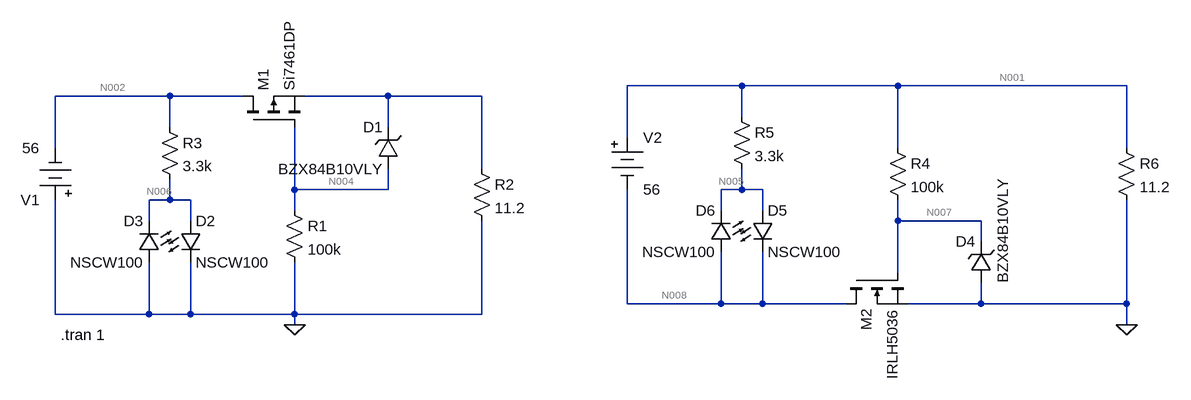
[diagram p0: schematic Polarity_Protection.asc]
Polarity_Protection.asc, the LTspice schematic file:
Version 4
SHEET 1 1516 680
WIRE 848 32 672 32
WIRE 1088 32 848 32
WIRE 1440 32 1088 32
WIRE -32 48 -208 48
WIRE 80 48 -32 48
WIRE 304 48 176 48
WIRE 448 48 304 48
WIRE 848 80 848 32
WIRE -32 96 -32 48
WIRE 304 96 304 48
WIRE 672 112 672 32
WIRE -208 128 -208 48
WIRE 1088 128 1088 32
WIRE 1440 128 1440 32
WIRE 448 160 448 48
WIRE 160 192 160 96
WIRE 304 192 304 160
WIRE 304 192 160 192
WIRE 848 192 848 160
WIRE 848 192 816 192
WIRE 880 192 848 192
WIRE -32 208 -32 176
WIRE -32 208 -64 208
WIRE 0 208 -32 208
WIRE 160 224 160 192
WIRE 816 224 816 192
WIRE 880 224 880 192
WIRE -64 240 -64 208
WIRE 0 240 0 208
WIRE 1088 240 1088 208
WIRE 1216 240 1088 240
WIRE 1216 272 1216 240
WIRE 1088 320 1088 240
WIRE 672 368 672 192
WIRE 816 368 816 288
WIRE 816 368 672 368
WIRE 880 368 880 288
WIRE 880 368 816 368
WIRE 1008 368 880 368
WIRE 1216 368 1216 336
WIRE 1216 368 1104 368
WIRE 1440 368 1440 208
WIRE 1440 368 1216 368
WIRE -208 384 -208 208
WIRE -64 384 -64 304
WIRE -64 384 -208 384
WIRE 0 384 0 304
WIRE 0 384 -64 384
WIRE 160 384 160 304
WIRE 160 384 0 384
WIRE 448 384 448 240
WIRE 448 384 160 384
WIRE 160 400 160 384
WIRE 1440 400 1440 368
FLAG 160 400 0
FLAG 1440 400 0
SYMBOL pmos 80 96 R270
SYMATTR InstName M1
SYMATTR Value Si7461DP
SYMBOL Misc\\battery -208 224 R180
WINDOW 123 0 0 Left 0
WINDOW 39 0 0 Left 0
SYMATTR InstName V1
SYMATTR Value 56
SYMBOL res 144 208 R0
SYMATTR InstName R1
SYMATTR Value 100k
SYMBOL zener 320 160 R180
WINDOW 0 24 64 Left 2
WINDOW 3 24 0 Left 2
SYMATTR InstName D1
SYMATTR Value BZX84B10VLY
SYMATTR Description Diode
SYMATTR Type diode
SYMBOL res 432 144 R0
SYMATTR InstName R2
SYMATTR Value 11.2
SYMBOL res -48 80 R0
SYMATTR InstName R3
SYMATTR Value 3.3k
SYMBOL LED -16 240 R0
SYMATTR InstName D2
SYMATTR Value NSCW100
SYMATTR Description Diode
SYMATTR Type diode
SYMBOL LED -48 304 R180
WINDOW 0 24 64 Left 2
WINDOW 3 24 0 Left 2
SYMATTR InstName D3
SYMATTR Value NSCW100
SYMATTR Description Diode
SYMATTR Type diode
SYMBOL nmos 1008 320 M90
SYMATTR InstName M2
SYMATTR Value IRLH5036
SYMBOL Misc\\battery 672 96 R0
WINDOW 123 0 0 Left 0
WINDOW 39 0 0 Left 0
SYMATTR InstName V2
SYMATTR Value 56
SYMBOL res 1072 112 R0
SYMATTR InstName R4
SYMATTR Value 100k
SYMBOL zener 1232 336 R180
WINDOW 0 24 64 Left 2
WINDOW 3 -18 0 VRight 2
SYMATTR InstName D4
SYMATTR Value BZX84B10VLY
SYMATTR Description Diode
SYMATTR Type diode
SYMBOL res 832 64 R0
SYMATTR InstName R5
SYMATTR Value 3.3k
SYMBOL LED 864 224 R0
SYMATTR InstName D5
SYMATTR Value NSCW100
SYMATTR Description Diode
SYMATTR Type diode
SYMBOL LED 832 288 R180
WINDOW 0 24 64 Left 2
WINDOW 3 24 0 Left 2
SYMATTR InstName D6
SYMATTR Value NSCW100
SYMATTR Description Diode
SYMATTR Type diode
SYMBOL res 1424 112 R0
SYMATTR InstName R6
SYMATTR Value 11.2
TEXT -200 416 Left 2 !.tran 1

The netlist it stands for:
* Polarity_Protection.asc
M1 N002 N004 N003 N003 Si7461DP
V1 0 N002 56
R1 N004 0 100k
D1 N004 N003 BZX84B10VLY
R2 N003 0 11.2
R3 N002 N006 3.3k
D2 N006 0 NSCW100
D3 0 N006 NSCW100
M2 N008 N007 0 0 IRLH5036
V2 N001 N008 56
R4 N001 N007 100k
D4 0 N007 BZX84B10VLY
R5 N001 N005 3.3k
D5 N005 N008 NSCW100
D6 N008 N005 NSCW100
R6 N001 0 11.2
.model D D
.lib standard.dio
.model NMOS NMOS
.model PMOS PMOS
.lib standard.mos
.tran 1
.backanno
.end

* Results of the author's LTspice run, read from the files saved beside the schematic
* Operating Point, zero values left out:
*   V(n006) = -3.554 V
*   V(n008) = -18.51 mV
*   V(n001) = 55.98 V
*   V(n002) = -56 V
*   V(n007) = 10.02 V
*   V(n005) = 3.536 V
*   Id(M1) = -305.5 pA
*   Is(M1) = 305.5 pA
*   I(R2) = -362 pA
*   I(R3) = -15.89 mA
*   I(D3) = 15.89 mA
*   I(R4) = 459.6 µA
*   I(R5) = 15.89 mA
*   I(R6) = 4.998 A
*   I(D5) = 15.89 mA
*   I(V1) = -15.89 mA
*   I(D4) = -459.6 µA
*   I(D2) = -16.88 nA
*   Id(M2) = -4.999 A
*   Is(M2) = 4.999 A
*   I(V2) = -5.015 A
*   I(D6) = -16.88 nA
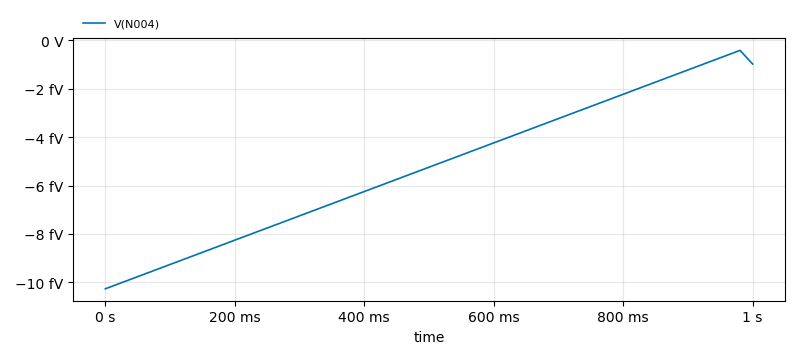
[diagram p1: Transient Analysis of Polarity_Protection.asc, plotted from the saved traces]
* Transient Analysis, 1 run:
*   V(N004): min -10.27 fV, max -0.4092 fV, average -5.247 fV, rms 7.194 fV, last -0.9746 fV